# EAGLE schematic esquemaProyecto (EAGLE 9.6.2)
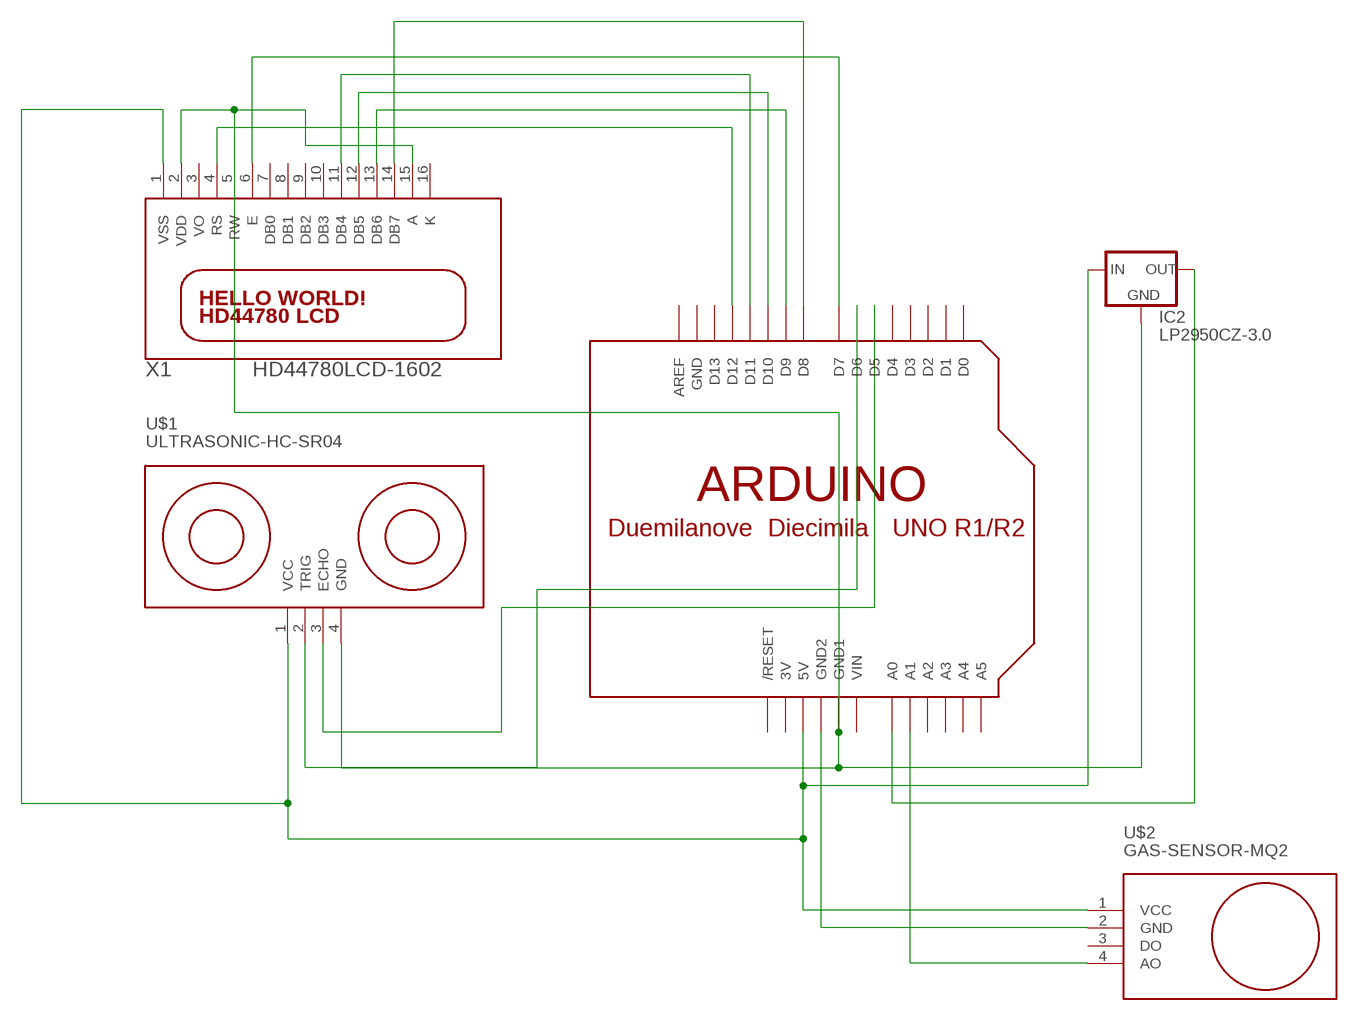
[diagram p0: schematic, sheet 1]

## Parts
IC2  LP2950CZ-3.0  [TO92]
U$1  ULTRASONIC-HC-SR04  [ULTRASONIC-HC-SR04]
U$2  GAS-SENSOR-MQ2  [GAS-SENSOR-MQ2]
U$3  ARDUINO-BPLACE  [ARDUINO-BPLACE]
X1  HD44780LCD-1602  [LCD1602]

## Nets
N$1: U$3.D12 X1.4(RS)
N$2: U$3.D7 X1.6(E)
N$3: U$3.D11 X1.11(DB4)
N$4: U$3.D10 X1.12(DB5)
N$5: U$3.D9 X1.13(DB6)
N$6: U$3.D8 X1.14(DB7)
N$7: U$1.2(TRIG) U$3.D6
N$8: U$1.3(ECHO) U$3.D5
N$9: IC2.1(OUT) U$3.A0
N$10: U$2.4(AO) U$3.A1
N$11: U$2.2(GND) U$3.GND2
VDD: IC2.2(GND) U$1.4(GND) U$3.GND1 X1.2(VDD) X1.5(RW) X1.15(A)
VSS: IC2.3(IN) U$1.1(VCC) U$2.1(VCC) U$3.5V X1.1(VSS)
Unconnected: U$2.3(DO) U$3.A2 U$3.A3 U$3.A4 U$3.A5 U$3.AREF U$3.D0 U$3.D1 U$3.D2 U$3.D3 U$3.D4 U$3.D13 U$3.RESET(/RESET) X1.3(VO) X1.7(DB0) X1.8(DB1) X1.9(DB2) X1.10(DB3) X1.16(K)

## Power pins joined to a net without a drawn wire
3V: U$3.3V
GND: U$3.GND
VIN: U$3.VIN

## Library data of the parts
IC2 = v-reg:LP2950?*: Source: http://cache.national.com/ds/LP/LP2950.pdf
U$1 = diy-modules:ULTRASONIC-HC-SR04: Ultrasonic Ranging Module HC-SR04 More details available here: http://randomnerdtutorials.com/complete-guide-for-ultrasonic-sensor-hc-sr04/ Click here to find device on ebay.com <http://www.ebay.com/sch/hc+sr04+ultrasonic>
U$2 = diy-modules:GAS-SENSOR-MQ2: Gas Sensor based on MQ-2 device Guide describing how to use MQ-2 sensor with Arduino is available here: http://www.instructables.com/id/How-to-use-MQ2-Gas-Sensor-Arduino-Tutorial/ MQ-2 sensor datasheet is available here: http://gas-sensor.ru/pdf/combustible-gas-sensor.pdf Click here to find device on ebay.com <http://www.ebay.com/sch/mq2+sensor+module+smoke>
U$3 = adafruit:ARDUINO: Arduino Diecimila/Duemilanove Make a shield with ease, this package has all the named pins as well as the two mounting drill holes and an outline of the USB and DC power connector. The outline is on the DIMENSION layer, so if your board house uses it they will cut the outline to match. http://www.ladyada.net/library/pcb/eaglelibrary.html
X1 = adafruit:HD44780LCD: HD44780 LCD Standard character type LCDs, available in sizes from 8x1 to 40x4!